# Altium schematic sheet 3V3.SchDoc
size A; SheetNumber: 2
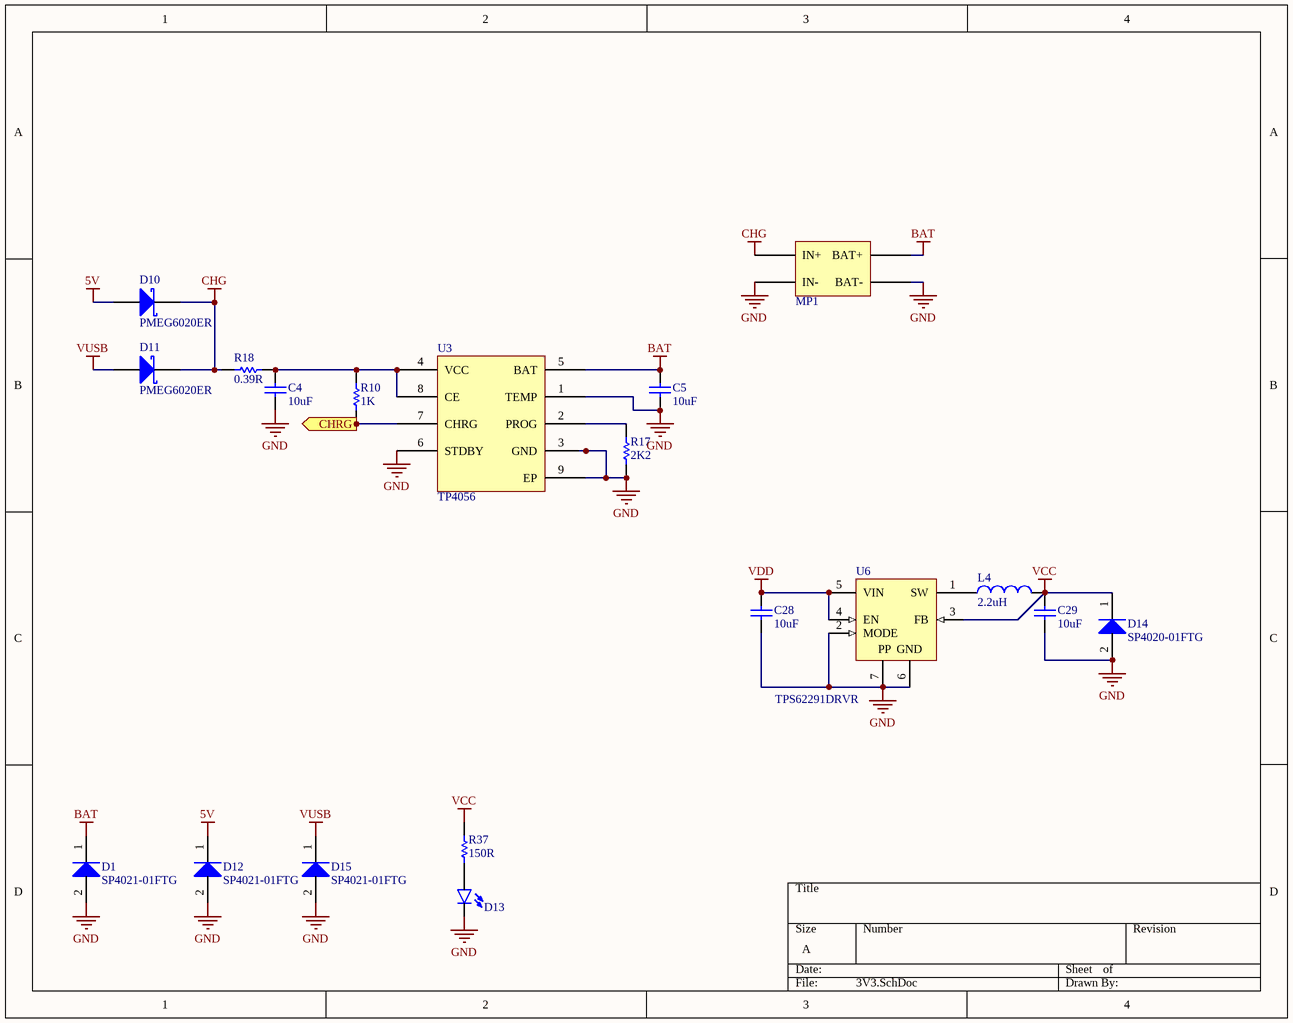
[diagram p0: 3V3.SchDoc]

## Parts
C4  value 10uF  [C1206[3216X160]]  (hidden comment: 10uF 50V 1206)
C5  value 10uF  [C1206[3216X160]]  (hidden comment: 10uF 50V 1206)
C28  value 10uF  [C0603[1608X92]]  (hidden comment: 10uF 16V 0603)
C29  value 10uF  [C0603[1608X92]]  (hidden comment: 10uF 6.3V 0603)
D1  SP4021-01FTG  [SOD-323]
D10  PMEG6020ER  [SOD-123]
D11  PMEG6020ER  [SOD-123]
D12  SP4021-01FTG  [SOD-323]
D13  LED_0603_GREEN_5mA  [LED0603]  (value not drawn)
D14  SP4020-01FTG  [SOD-323]
D15  SP4021-01FTG  [SOD-323]
L4  2.2uH  [IND0805]
MP1  Li-ion CHARGER  [LI-ION CHARGER]  (value not drawn)
R10  value 1K  [R0603[1608]]  (hidden comment: 1K 1% 0603)
R17  value 2K2  [R0603[1608]]  (hidden comment: 2K2 1% 0603)
R18  value 0.39R  [R1206[3216]]  (hidden comment: 0.39R 1% 1206)
R37  value 150R  [R0603[1608]]  (hidden comment: 150R 1% 0603)
U3  TP4056  [SOIC-8-EP]
U6  TPS62291DRVR  [WSON-6]

## Ports
CHRG (out)

## Nets
5V: D10.2(A) D12.1(K)
BAT: C5.2 D1.1(K) MP1.3(BAT+) U3.5(BAT)
CHG: D10.1(K) D11.1(K) MP1.1(IN+) R18.2
GND: C4.1 C5.1 C28.1 C29.1 D1.2(A) D12.2(A) D13.C D14.2(A) D15.2(A) MP1.2(IN-) MP1.4(BAT-) R17.1 U3.1(TEMP) U3.3(GND) U3.6(STDBY) U3.9(EP) U6.2(MODE) U6.6(GND) U6.7(EP)
VCC: C29.2 D14.1(K) L4.2 R37.2 U6.3(FB)
VDD: C28.2 U6.4(EN) U6.5(VIN)
VUSB: D11.2(A) D15.1(K)
CHRG: R10.1 U3.7(CHRG) ; port CHRG
NetC4_2: C4.2 R10.2 R18.1 U3.4(VCC) U3.8(CE)
NetD13_A: D13.A R37.1
NetL4_1: L4.1 U6.1(SW)
NetR17_2: R17.2 U3.2(PROG)

## Notes on the sheet
- (in symbol TPS62291DRVR) PP

## Library data of the parts
C4 C5 = CAP_10uF_50V_1206_20%: 10uF 50V 20% 1206 (3216 Metric); PartNumber: UMK316BBJ106ML-T; Manufacturer: Taiyo Yuden; Mounting Technology: Surface Mount; PackageReference: 1206; PackageDescription: 1206 (3216 Metric); Voltage: 50V; Tolerance: 20%
C28 = CAP_10uF_16V_0603_10%: 10uF 16V 10% 0603 (1608 Metric); PartNumber: GRM188R61C106KAALD; Manufacturer: Murata; TemperatureCoefficient: X5R; Mounting Technology: Surface Mount; PackageReference: 0603; PackageDescription: 0603 (1608 Metric); Voltage: 16V; Tolerance: 10%
C29 = CAP_10uF_6.3V_0603_10%: 10uF 6.3V 10% 0603 (1608 Metric); PartNumber: GRM188R60J106KE47D; Manufacturer: Murata; TemperatureCoefficient: X5R; Mounting Technology: Surface Mount; PackageReference: 0603; PackageDescription: 0603 (1608 Metric); Voltage: 6.3V; Tolerance: 10%
D1 D12 D15 = SP4021-01FTG: Manufacturer: Littelfuse; PartNumber: SP4021-01FTG; PackageReference: SOD-323-2; Mounting Technology: Surface Mount
D10 D11 = PMEG6020ER: PartNumber: PMEG6020ER,115; Manufacturer: NXP Semiconductors; PackageReference: SOD-123W; PackageDescription: SOD, 2-Leads, Body 2.69x1.6mm; Mounting Technology: Surface Mount
D13 = LED_0603_GREEN_5mA: PartNumber: LTST-C193TGKT-5A; Manufacturer: Lite-On Inc.; PackageReference: 0603; PackageDescription: 0603 (1608 Metric); Mounting Technology: Surface Mount
D14 = SP4020-01FTG: Manufacturer: Littelfuse; PartNumber: SP4020-01FTG; PackageReference: SOD-323-2; Mounting Technology: Surface Mount
L4 = IND_2.2uH_1.7A_0805_20%: 2.2uH 20% 1.7A 0805; PartNumber: LQM21PN2R2MGHL; Manufacturer: Murata; PackageReference: 0805; PackageDescription: 0805 (2012 metric); Value: 2.2uH; Mounting Technology: Surface Mount; Current: 1.7A
MP1 = Li-ion CHARGER: TP4056 LI-ION, LI-POLYMER 1-CELL CHARGER; Manufacturer: ELEPARTS; PartNumber: Micro USB 1A
R10 = RES_1K_0603_1%: 1K 0.25W 1% 0603 (1005 Metric); Manufacturer: Vishay / Dale; PartNumber: CRCW06031K00FKEAHP; Tolerance: 1%; Power: 0.25W; Mounting Technology: Surface Mount; PackageReference: 0603; PackageDescription: 0603 (1608 Metric); ComponentLink1Description: Datasheet; ComponentLink1URL: http://www.vishay.com/docs/20043/crcwhpe3.pdf
R17 = RES_2K2_0603_1%: 2K2 0.25W 1% 0603 (1005 Metric); Manufacturer: Vishay / Dale; PartNumber: CRCW06032K20FKEAHP; Tolerance: 1%; Power: 0.25W; Mounting Technology: Surface Mount; PackageReference: 0603; PackageDescription: 0603 (1608 Metric); ComponentLink1Description: Datasheet; ComponentLink1URL: http://www.vishay.com/docs/20043/crcwhpe3.pdf
R18 = RES_0.39R_1206_1%: 0.39R 0.5W 1% 1206 (3216 Metric); Manufacturer: Vishay Dale; PartNumber: RCWE1206R390FKEA; Tolerance: 1%; Power: 0.5W; Mounting Technology: Surface Mount; PackageReference: 1206; PackageDescription: 1206 (3216 Metric); ComponentLink1Description: Datasheet; ComponentLink1URL: https://industrial.panasonic.com/cdbs/www-data/pdf/RDA0000/AOA0000C239.pdf
R37 = RES_150R_0603_1%: 150R 0.25W 1% 0603 (1005 Metric); Manufacturer: Vishay / Dale; PartNumber: CRCW0603150RFKEAHP; Tolerance: 1%; Power: 0.25W; Mounting Technology: Surface Mount; PackageReference: 0603; PackageDescription: 0603 (1608 Metric); ComponentLink1Description: Datasheet; ComponentLink1URL: http://www.vishay.com/docs/20043/crcwhpe3.pdf
U3 = TP4056: 1 CELL Li-ion Battery Charger; Manufacturer: Nanjing Extension Microelectronics; PartNumber: TP4056; PackageReference: SOP-8; Mounting Technology: Surface Mount
U6 = TPS62291DRVR: Voltage Regulators - Switching Regulators 2.25MHz 1A Step-Down Cnvrtr 3.3V Output; Manufacturer: Texas Instruments; PartNumber: TPS62291DRVR; PackageReference: WSON-6; PackageDescription: SON, 6-Leads, Body 2x2mm, Pitch 0.65mm, Thermal Pad 1.6x1mm, TI Recommended; Mounting Technology: Surface Mount